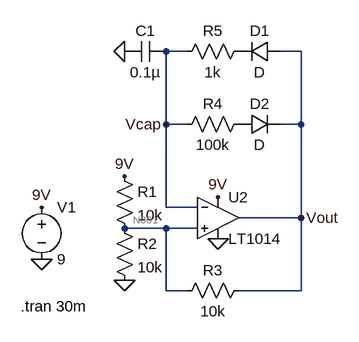
[diagram p0: schematic schmittSimulation.asc]
schmittSimulation.asc, the LTspice schematic file:
Version 4.1
SHEET 1 880 680
WIRE 256 -112 224 -112
WIRE 432 -112 400 -112
WIRE 224 0 224 -112
WIRE 256 0 224 0
WIRE 432 0 432 -112
WIRE 432 0 400 0
WIRE 224 128 224 0
WIRE 272 128 224 128
WIRE 432 144 432 0
WIRE 432 144 336 144
WIRE 224 160 160 160
WIRE 272 160 224 160
WIRE 224 256 224 160
WIRE 256 256 224 256
WIRE 432 256 432 144
WIRE 432 256 336 256
FLAG 32 208 0
FLAG 32 128 9V
FLAG 304 176 0
FLAG 304 112 9V
FLAG 160 80 9V
FLAG 160 240 0
FLAG 160 -112 0
FLAG 432 144 Vout
FLAG 224 0 Vcap
SYMBOL voltage 32 112 R0
WINDOW 123 0 0 Left 0
WINDOW 39 0 0 Left 0
SYMATTR InstName V1
SYMATTR Value 9
SYMBOL res 144 64 R0
SYMATTR InstName R1
SYMATTR Value 10k
SYMBOL res 144 144 R0
SYMATTR InstName R2
SYMATTR Value 10k
SYMBOL res 352 240 R90
WINDOW 0 0 56 VBottom 2
WINDOW 3 32 56 VTop 2
SYMATTR InstName R3
SYMATTR Value 10k
SYMBOL res 352 -16 R90
WINDOW 0 0 56 VBottom 2
WINDOW 3 32 56 VTop 2
SYMATTR InstName R4
SYMATTR Value 100k
SYMBOL res 352 -128 R90
WINDOW 0 0 56 VBottom 2
WINDOW 3 32 56 VTop 2
SYMATTR InstName R5
SYMATTR Value 1k
SYMBOL diode 400 -128 R90
WINDOW 0 0 32 VBottom 2
WINDOW 3 32 32 VTop 2
SYMATTR InstName D1
SYMBOL diode 336 16 R270
WINDOW 0 32 32 VTop 2
WINDOW 3 0 32 VBottom 2
SYMATTR InstName D2
SYMBOL cap 224 -128 R90
WINDOW 0 0 32 VBottom 2
WINDOW 3 32 32 VTop 2
WINDOW 39 28 32 VBottom 2
SYMATTR InstName C1
SYMATTR Value 0.1µ
SYMBOL OpAmps\\LT1014 304 80 R0
SYMATTR InstName U2
TEXT 0 280 Left 2 !.tran 30m

The netlist it stands for:
* schmittSimulation.asc
V1 9V 0 9
R1 9V N001 10k
R2 N001 0 10k
R3 Vout N001 10k
R4 P001 Vcap 100k
R5 P002 Vcap 1k
D1 Vout P002 D
D2 P001 Vout D
C1 Vcap 0 0.1µ
X§U2 N001 Vcap 9V 0 Vout LT1014  ; pins In+ In- V+ V- OUT
.model D D
.lib standard.dio
.tran 30m
.backanno
.end

* Results of the author's LTspice run, read from the files saved beside the schematic
* Operating Point, zero values left out:
*   V(9v) = 9 V
*   V(n001) = 4.318 V
*   V(p001) = 4.317 V
*   V(p002) = 4.318 V
*   V(vcap) = 4.318 V
*   V(vout) = 3.955 V
*   I(D2) = 12.02 nA
*   I(R1) = 468.2 µA
*   I(R2) = 431.8 µA
*   I(R3) = -36.33 µA
*   I(R4) = -12.02 nA
*   I(V1) = -800.2 µA
*   Ix(u2:1) = -12.02 nA
*   Ix(u2:2) = -12.02 nA
*   Ix(u2:3) = 332.1 µA
*   Ix(u2:4) = -368.4 µA
*   Ix(u2:5) = 36.34 µA
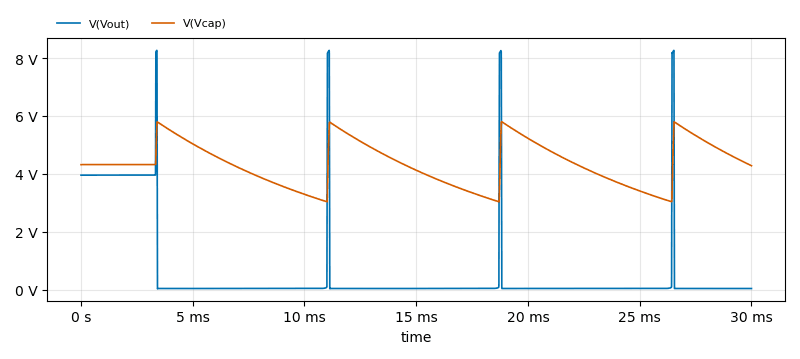
[diagram p1: Transient Analysis of schmittSimulation.asc, plotted from the saved traces]
* Transient Analysis, 1 run:
*   V(Vout): min 28.37 mV, max 8.265 V, average 581.3 mV, rms 1.603 V, last 38.12 mV
*   V(Vcap): min 3.035 V, max 5.803 V, average 4.344 V, rms 4.409 V, last 4.281 V